# Altium schematic sheet 22pF SMD Ceramic 603.schdoc
size 127 x 101 mm
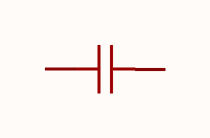
[diagram p0: 22pF SMD Ceramic 603.schdoc]

## Parts
C?  22pF  [C0603]  (value not drawn)

## Nets

Not connected (* = marked no-connect by the designer): C? 1 2

## Library data of the parts
C? = C0603C220J4GAC7867: Manufacturer: KEMET(基美); Add into BOM: yes; Tolerance: ±5%; Symbol: C0603C220J4GAC7867; Device: C0603C220J4GAC7867; LCSC Part Name: 22pF ±5% 16V; Supplier Part: C561800; Manufacturer Part: C0603C220J4GAC7867; Supplier Footprint: 0603; JLCPCB Part Class: Extended Part; Datasheet: https://atta.szlcsc.com/upload/public/pdf/source/20200618/C561800_1756A88345AB30E1FCE50DFDDC46141D.pdf; Supplier: LCSC; Convert to PCB: yes; Value: 22pF